# EAGLE design telescopicrobot (EAGLE 9.6.2)
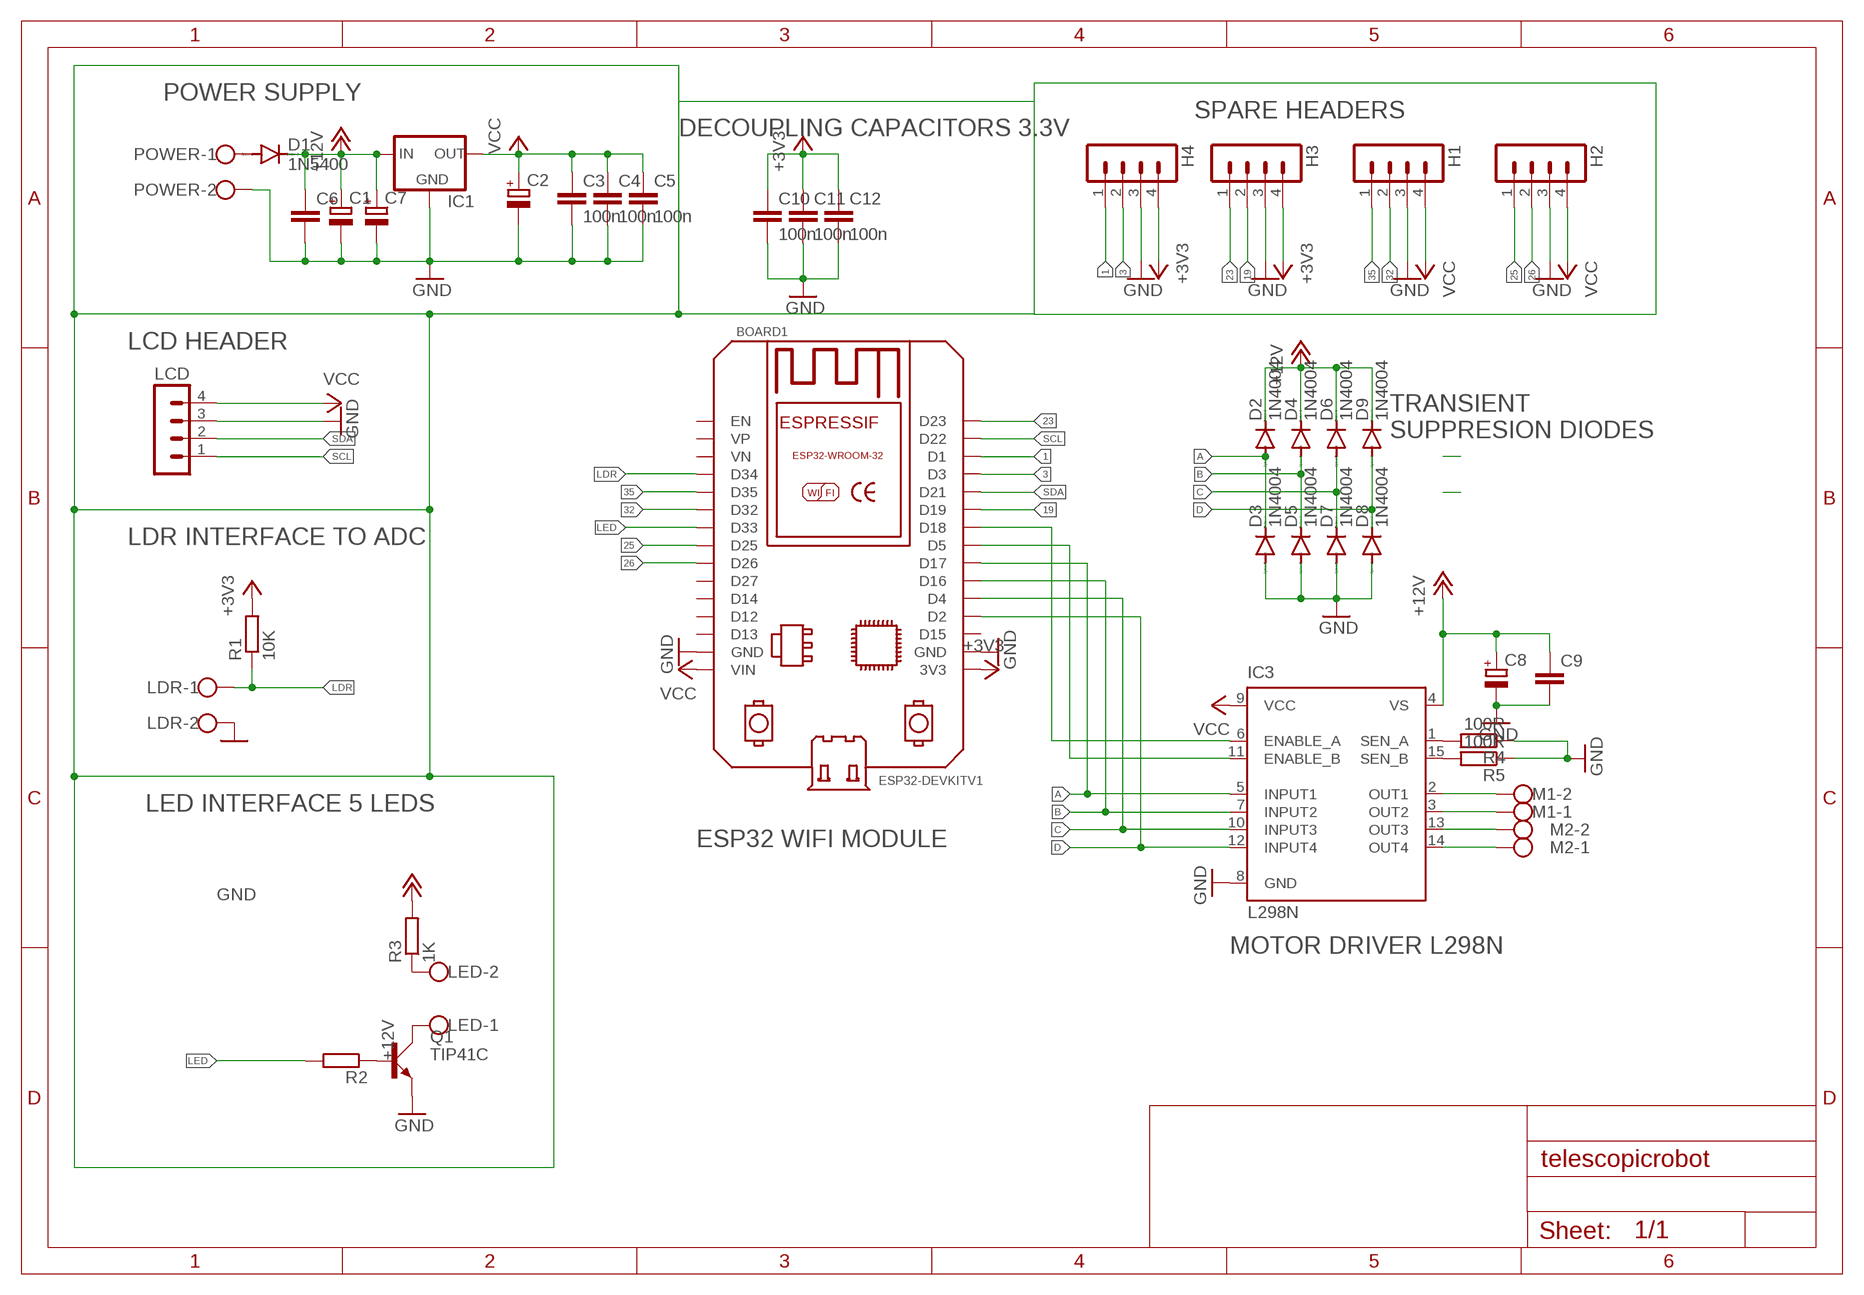
[diagram p0: schematic, sheet 1]

## Parts
BOARD1  ESP32DEVKITV1  [ESP32-DEVKITV1]
C1  CPOL-EUE5-10.5  [E5-10,5]
C2  CPOL-EUE2.5-5  [E2,5-5]
C3  100n  C2,5-3  [C2.5-3]
C4  100n  C2,5-3  [C2.5-3]
C5  100n  C2,5-3  [C2.5-3]
C6  C2,5-3  [C2.5-3]
C7  CPOL-EUE5-10.5  [E5-10,5]
C8  CPOL-EUE5-10.5  [E5-10,5]
C9  C2,5-3  [C2.5-3]
C10  100n  C2,5-3  [C2.5-3]
C11  100n  C2,5-3  [C2.5-3]
C12  100n  C2,5-3  [C2.5-3]
D1  1N5400  [DO201-15]
D2  1N4004  [DO41-10]
D3  1N4004  [DO41-10]
D4  1N4004  [DO41-10]
D5  1N4004  [DO41-10]
D6  1N4004  [DO41-10]
D7  1N4004  [DO41-10]
D8  1N4004  [DO41-10]
D9  1N4004  [DO41-10]
H1  MA04-1  [MA04-1]
H2  MA04-1  [MA04-1]
H3  MA04-1  [MA04-1]
H4  MA04-1  [MA04-1]
IC1  78XXS  [78XXS]
IC3  L298N  [MULTIWATT-15]
LCD  MA04-1  [MA04-1]
LDR  W237-102  [W237-102]
LED  W237-102  [W237-102]
M1  W237-102  [W237-102]
M2  W237-102  [W237-102]
POWER  W237-102  [W237-102]
Q1  TIP41C  [TO220AV]
R1  10K  R-EU_0207/12  [0207/12]
R2  R-EU_0207/12  [0207/12]
R3  1K  R-EU_0207/12  [0207/12]
R4  100R  R-EU_0207/12  [0207/12]
R5  100R  R-EU_0207/12  [0207/12]

## Nets
1: BOARD1.D1 H4.1
3: BOARD1.D3 H4.2
19: BOARD1.D19 H3.2
23: BOARD1.D23 H3.1
25: BOARD1.D25 H2.1
26: BOARD1.D26 H2.2
32: BOARD1.D32 H1.2
35: BOARD1.D35 H1.1
+3V3: BOARD1.3V3 C10.1 C11.1 C12.1 H3.4 H4.4 R1.2
+12V: C1.+ C6.1 C7.+ C8.+ C9.1 D1.C D2.C D4.C D6.C D9.C IC1.IN IC3.4(VS) R3.2
A: BOARD1.D17 D2.A D3.C IC3.5(INPUT1)
B: BOARD1.D16 D4.A D5.C IC3.7(INPUT2)
C: BOARD1.D4 D6.A D7.C IC3.10(INPUT3)
D: BOARD1.D2 D8.C D9.A IC3.12(INPUT4)
GND: BOARD1.GND BOARD1.GND@1(GND) C1.- C2.- C3.2 C4.2 C5.2 C6.2 C7.- C8.- C9.2 C10.2 C11.2 C12.2 D3.A D5.A D7.A D8.A H1.3 H2.3 H3.3 H4.3 IC1.GND IC3.8(GND) LCD.3 LDR.2 POWER.2 Q1.E R4.1 R5.1
LDR: BOARD1.D34 LDR.1 R1.1
LED: BOARD1.D33 R2.2
N$1: LED.1 Q1.C
N$2: IC3.3(OUT2) M1.1
N$3: IC3.2(OUT1) M1.2
N$4: IC3.14(OUT4) M2.1
N$5: IC3.13(OUT3) M2.2
N$6: Q1.B R2.1
N$7: BOARD1.D18 IC3.6(ENABLE_A)
N$8: D1.A POWER.1
N$9: LED.2 R3.1
N$13: BOARD1.D5 IC3.11(ENABLE_B)
N$143: IC3.1(SEN_A) R4.2
N$145: IC3.15(SEN_B) R5.2
SCL: BOARD1.D22 LCD.1
SDA: BOARD1.D21 LCD.2
VCC: BOARD1.VIN C2.+ C3.1 C4.1 C5.1 H1.4 H2.4 IC1.OUT IC3.9(VCC) LCD.4
Unconnected: BOARD1.D12 BOARD1.D13 BOARD1.D14 BOARD1.D15 BOARD1.D27 BOARD1.EN BOARD1.VN BOARD1.VP

## Notes on the sheet
- POWER SUPPLY
- SPARE HEADERS
- DECOUPLING CAPACITORS 3.3V
- LCD HEADER
- TRANSIENT
  SUPPRESION DIODES
- LDR INTERFACE TO ADC
- LED INTERFACE 5 LEDS
- ESP32 WIFI MODULE
- MOTOR DRIVER L298N

## Library data of the parts
BOARD1 = ESP32-DEVKITV1:ESP32DEVKITV1: https://github.com/shridattdudhat
C1 C2 C7 C8 = rcl:CPOL-EU: POLARIZED CAPACITOR, European symbol; SPICEPREFIX: C
C3-C6 C9-C12 = capacitor-wima:C: CAPACITOR naming: grid - package width
D1 = diode:1N5400: DIODE standard rectifier, 3 A, 50 V (Motorola)
D2-D9 = diode:1N4004: DIODE general purpose rectifier, 1 A
H1-H4 LCD = con-lstb:MA04-1: PIN HEADER; OC_FARNELL: unknown; OC_NEWARK: unknown
IC1 = v-reg:78XXS: VOLTAGE REGULATOR
IC3 = Itead_IC_110429:L298N: ICP007
LDR LED M1 M2 POWER = con-wago-500:W237-102: WAGO SCREW CLAMP; MPN: 237-102; OC_FARNELL: unknown; OC_NEWARK: 70K9898
Q1 = transistor-power:TIP41C: NPN TRANSISTOR
R1 R2 = rcl:R-EU_: RESISTOR, European symbol; SPICEPREFIX: R
R3-R5 = resistor:R-EU_: RESISTOR, European symbol

## Board
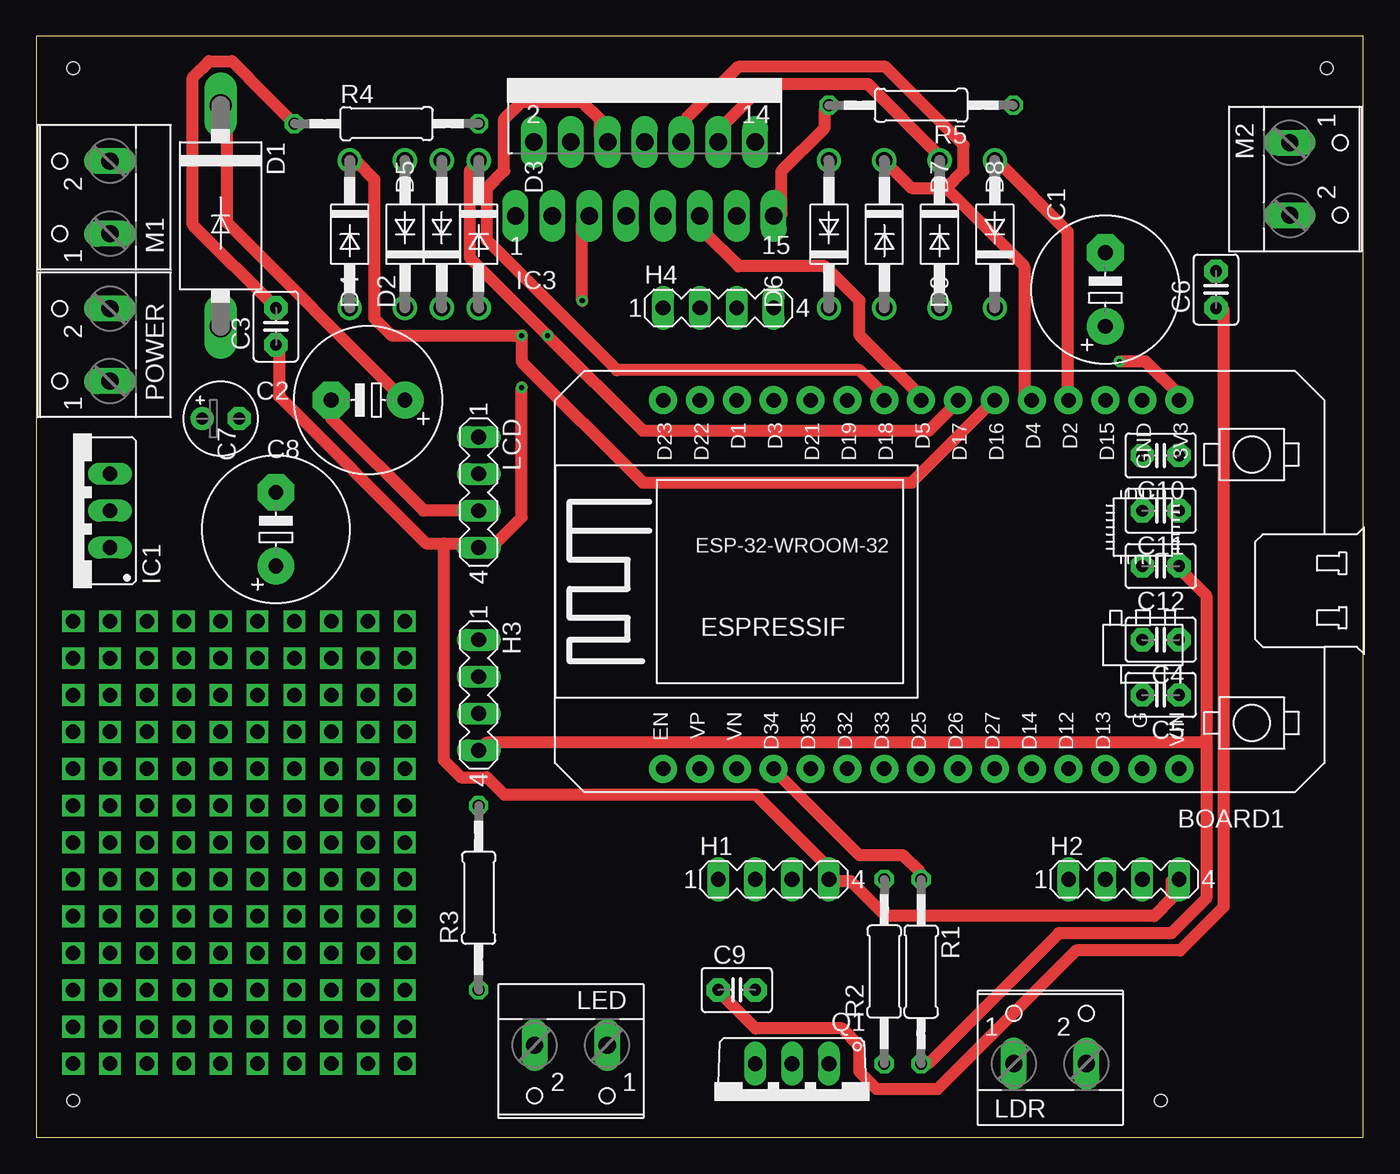
[diagram p1: board, top side]
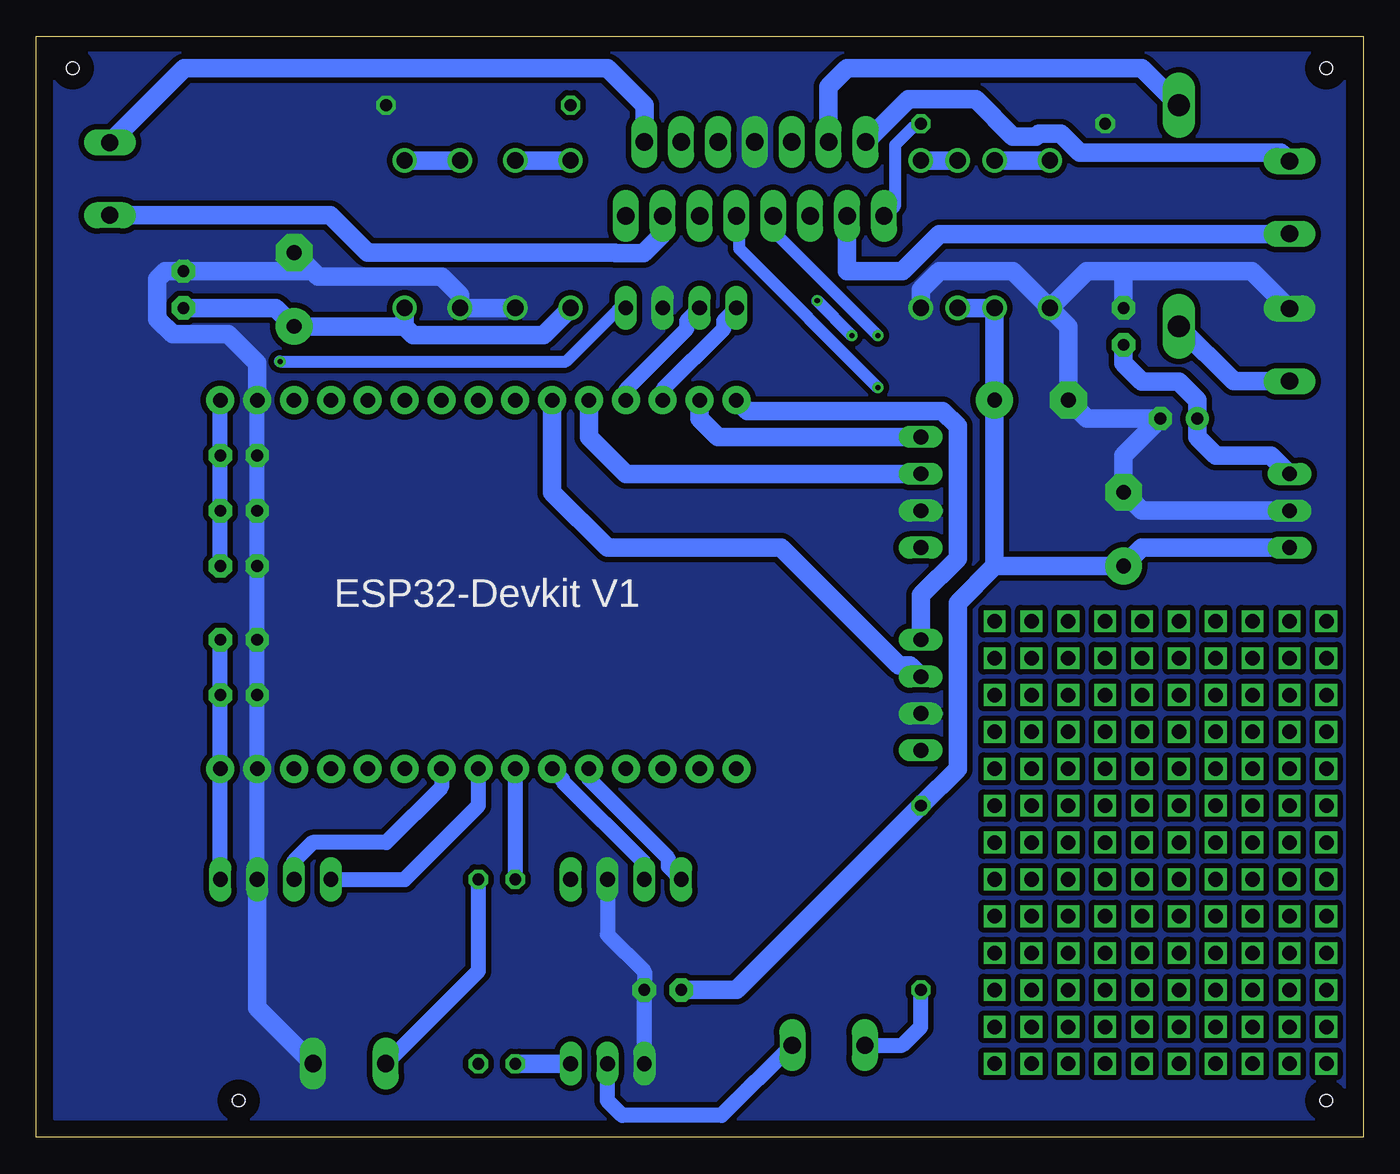
[diagram p2: board, bottom side, seen from below]

Size 91.42 x 75.87 mm. Coordinates in mm from the lower left corner, seen from the top.
Outline: 0,0 91.42,0 91.42,75.87 0,75.87 0,0
Copper layers (1*16): Top 0.035mm / dielectric 1.5mm / Bottom 0.035mm
Design rules "default *": minimum track width 32mil, minimum drill 0.35mm, track to track 15mil, track to pad 15mil, pad to pad 6mil, via to via 6mil, smd to smd 6mil, copper to edge 40mil, drill to drill 6mil, minimum pad ring 10mil, minimum via ring 8mil, stop-mask expansion 4mil, vias tented up to drill 0mil, thermal gap 0mil
Holes 0.85 mm at 2.54,2.54 88.9,73.66 2.54,73.66 77.47,2.54

### Footprints (pad centres in the part's own frame; a part is rotated, then mirrored left to right if it is on the bottom)
ESP32-DEVKITV1 = drill 1 pad 1.93: 3V3 0,0; D1 30.48,0; D2 7.62,0; D3 27.94,0; D4 10.16,0; D5 17.78,0; D12 7.62,25.4; D13 5.08,25.4; D14 10.16,25.4; D15 5.08,0; D16 12.7,0; D17 15.24,0; D18 20.32,0; D19 22.86,0; D21 25.4,0; D22 33.02,0; D23 35.56,0; D25 17.78,25.4; D26 15.24,25.4; D27 12.7,25.4; D32 22.86,25.4; D33 20.32,25.4; D34 27.94,25.4; D35 25.4,25.4; EN 35.56,25.4; GND 2.54,25.4; GND@1 2.54,0; VIN 0,25.4; VN 30.48,25.4; VP 33.02,25.4
E5-10,5 = drill 1.016 pad 2.54: + -2.54,0 | drill 1.016 pad 2.54 octagon: - 2.54,0
E2,5-5 = drill 0.813 pad 1.6: + -1.27,0 | drill 0.813 pad 1.6 octagon: - 1.27,0
C2.5-3 = drill 0.813 pad 1.6 octagon: 1 -1.27,0; 2 1.27,0
DO201-15 = drill 1.499 long: A 7.62,0; C -7.62,0
DO41-10 = drill 1.118: A 5.08,0; C -5.08,0
MA04-1 = drill 1.016 long: 1 -3.81,0; 2 -1.27,0; 3 1.27,0; 4 3.81,0
78XXS = drill 1.016 long: GND 0,-2.54; IN -2.54,-2.54; OUT 2.54,-2.54
MULTIWATT-15 = drill 1.2 long: 1 -8.89,-7.62; 2 -7.62,-2.54; 3 -6.35,-7.62; 4 -5.08,-2.54; 5 -3.81,-7.62; 6 -2.54,-2.54; 7 -1.27,-7.62; 8 0,-2.54; 9 1.27,-7.62; 10 2.54,-2.54; 11 3.81,-7.62; 12 5.08,-2.54; 13 6.35,-7.62; 14 7.62,-2.54; 15 8.89,-7.62
W237-102 = drill 1.194 long: 1 -2.5,-1.27; 2 2.5,-1.27
TO220AV = drill 1.016 long: B -2.54,-2.54; C 0,-2.54; E 2.54,-2.54
0207/12 = drill 0.813 octagon: 1 -6.35,0; 2 6.35,0

### Placement (x,y rotation side)
BOARD1  78.74,50.8 180 top
C1  73.66,58.42 90 top
C2  12.7,49.53 0 top
C3  16.51,55.88 90 top
C4  77.47,34.29 180 top
C5  77.47,30.48 180 top
C6  81.28,58.42 90 top
C7  16.51,41.91 90 top
C8  22.86,50.8 180 top
C9  48.26,10.16 0 top
C10  77.47,46.99 180 top
C11  77.47,43.18 180 top
C12  77.47,39.37 180 top
D1  12.7,63.5 270 top
D2  27.94,62.23 90 top
D3  30.48,62.23 270 top
D4  25.4,62.23 90 top
D5  21.59,62.23 270 top
D6  54.61,62.23 90 top
D7  58.42,62.23 270 top
D8  62.23,62.23 270 top
D9  66.04,62.23 90 top
H1  50.8,17.78 0 top
H2  74.93,17.78 0 top
H3  30.48,30.48 270 top
H4  46.99,57.15 0 top
IC1  2.54,43.18 90 top
IC3  41.91,71.12 0 top
LCD  30.48,44.45 270 top
LDR  69.85,6.35 0 top
LED  36.83,5.08 180 top
M1  3.81,64.77 90 top
M2  87.63,66.04 270 top
POWER  3.81,54.61 90 top
Q1  52.07,2.54 180 top
R1  60.96,11.43 270 top
R2  58.42,11.43 90 top
R3  30.48,16.51 90 top
R4  24.13,69.85 0 top
R5  60.96,71.12 180 top

### Tracks (layer width: path | path; a pad name or v marks a point on that pad's centre or on a via)
1
  Bottom 1.016: H4.1 44.07,56.26 44.07,55.7 48.26,51.51 BOARD1.D1
3
  Bottom 1.016: H4.2 46.61,56.26 46.61,55.7 50.8,51.51 BOARD1.D3
19
  Bottom 1.27: H3.2 31.24,32.51 31.98,32.51 40.11,40.64 52.07,40.64 55.88,44.45 BOARD1.D19
23
  Bottom 1.27: H3.1 30.48,37.36 27.94,39.9 27.94,49 28.98,50.04 42.42,50.04 BOARD1.D23
25
  Bottom 1.016: H2.1 66.04,17.78 60.96,22.86 BOARD1.D25
26
  Bottom 1.016: BOARD1.D26 63.5,24.13 67.31,20.32 72.39,20.32 73.66,19.05 H2.2
32
  Bottom 1.016: BOARD1.D32 55.19,24.71 55.19,24.57 49.53,18.9 H1.2
35
  Bottom 1.016: H1.1 47.88,18.67 47.88,19.23 53.34,24.69 BOARD1.D35
+3V3  (via drill 0.35)
  Top 0.813: 80.59,27.2 80.59,37.35 78.8,39.14 C12.1 | 80.59,27.2 80.59,16.46 78.21,14.07 70.45,14.07 61.49,5.12 R1.2 | 80.59,27.2 31.05,27.2 H3.4 | v74.62,53.47 76.42,53.47 78.8,51.08 BOARD1.3V3
  Bottom 0.813: v74.62,53.47 54.93,53.47 51.35,57.05 H4.4
  Bottom 1.016: C12.1 C11.1 C10.1 BOARD1.3V3
+12V
  Top 0.813: D1.C 13.14,70.78 13.14,63.02 25.08,51.08 C8.+ | C9.1 47.17,9.89 49.56,7.51 55.52,7.51 56.72,6.31 56.72,4.52 57.91,3.33 62.09,3.33 71.64,12.88 78.8,12.88 81.79,15.86 81.79,57.05 C6.1
  Bottom 1.27: IC1.IN 15.24,40.64 C7.+ 25.4,39.37 | 25.4,39.37 27.94,36.83 27.94,25.4 R3.2 43.18,10.16 C9.1 | 25.4,39.37 C8.+ D4.C D2.C | D6.C 56.46,55.3 65.46,55.3 66.04,55.88 | 66.04,55.88 D9.C | 66.04,55.88 C1.+ 74.93,57.15 C6.1 | D1.C 15.24,73.66 35.56,73.66 36.83,72.39 IC3.4
A  (via drill 0.35)
  Top 0.813: v37.62,57.65 37.62,63.02 IC3.5 | D3.C 30.46,67.2 29.86,66.6 29.86,60.63 v35.23,55.26 41.8,48.69 61.49,48.69 63.28,50.48 BOARD1.D17
  Bottom 0.813: v35.23,55.26 v37.62,57.65
  Bottom 1.27: D2.A D3.C
B  (via drill 0.35)
  Top 0.813: D5.C 22.1,67.2 23.29,66 23.29,56.45 24.49,55.26 v33.44,55.26 33.44,53.47 41.8,45.11 60.3,45.11 65.67,50.48 BOARD1.D16
  Bottom 0.813: v33.44,55.26 40.6,62.42 40.6,63.02 IC3.7
  Bottom 1.27: D5.C D4.A
C
  Top 0.813: 62.69,65.41 63.88,66.6 63.88,68.39 58.51,73.76 48.36,73.76 44.78,70.18 44.78,68.99 IC3.10 | 62.69,65.41 60.3,65.41 58.51,67.2 D7.C | 62.69,65.41 68.06,60.03 68.06,51.08 BOARD1.D4
  Bottom 1.27: D6.A D7.C
D
  Top 0.813: IC3.12 47.17,68.99 47.17,69.58 50.15,72.57 57.31,72.57 62.09,67.79 D8.C | BOARD1.D2 71.04,51.08 71.04,62.42 66.27,67.2 D9.A
  Bottom 1.27: D8.C D9.A
GND
  Top 0.813: LCD.3 26.67,43.18 20.32,49.53 C8.- | C3.2 10.79,62.87 10.79,73.04 11.91,74.16 13.49,74.16 14.61,73.04 14.61,73.02 R4.1
  Bottom 0.813: LCD.3 30.66,43.37 30.58,43.28
  Bottom 1.016: Q1.E C9.2 49.53,11.43 52.07,13.97 H1.3 | H2.3 BOARD1.GND C5.2 C4.2 C12.2 C11.2 C10.2 BOARD1.GND@1
  Bottom 1.27: D5.A 20.32,55.88 C8.- 19.05,49.53 C2.- 16.51,46.99 C7.- 15.24,43.18 IC1.GND | POWER.2 7.66,59.69 16.51,59.69 | D5.A 19.05,59.69 16.51,59.69 | D5.A 24.13,59.69 29.21,59.69 30.48,58.42 D3.A | H2.3 76.2,8.93 LDR.2 | C3.2 16.51,59.69 | D7.A D8.A 62.23,58.04 63.5,59.31 72.01,59.31 72.39,59.69 | C1.- 72.39,59.69 | 72.39,59.69 C6.2 82.55,59.69 83.1,59.14 83.1,56.4 82.03,55.33 78.19,55.33 76.2,53.34 BOARD1.GND@1
  pour Bottom: 1.27,74.93 90.17,74.93 90.17,1.27 1.27,1.27
LDR
  Top 0.813: BOARD1.D34 51.35,24.82 56.72,19.44 59.7,19.44 60.9,18.25 R1.1
  Bottom 1.016: LDR.1 60.96,11.47 R1.1
LED
  Bottom 1.016: BOARD1.D33 R2.2
N$1
  Bottom 1.016: LED.1 39.37,6.35 44.2,1.52 51.05,1.52 52.07,2.54 Q1.C
N$2
  Bottom 1.27: M1.1 5.12,62.23 29.21,62.23 31.75,59.69 35.56,59.69 IC3.3
N$3
  Bottom 1.27: M1.2 5.67,67.86 19.51,67.86 20.82,69.16 22.36,69.16 22.56,68.96 24.13,68.96 26.7,71.53 31.34,71.53 IC3.2
N$4
  Bottom 1.27: M2.1 81.24,73.66 52.07,73.66 49.53,71.12 IC3.14
N$5
  Bottom 1.27: IC3.13 48.26,62.23 49.58,60.91 51.5,60.91 51.55,60.96 68.58,60.96 71.16,63.54 M2.2
N$6
  Bottom 1.27: Q1.B R2.1
N$7
  Top 0.813: IC3.6 38.81,68.99 38.81,70.18 37.62,71.37 33.44,71.37 32.25,70.18 32.25,66.6 31.05,65.41 31.05,61.82 40,52.87 56.72,52.87 58.51,51.08 BOARD1.D18
N$8
  Bottom 1.27: POWER.1 8.93,52.11 D1.A
N$9
  Bottom 1.016: LED.2 31.75,6.35 30.48,7.62 R3.1
N$10  (via drill 1)
  other vias: 2.54,35.56
N$13
  Top 0.813: IC3.11 45.97,63.02 45.97,62.42 48.36,60.03 54.33,60.03 56.72,57.65 56.72,55.26 60.9,51.08 BOARD1.D5
N$14  (via drill 1)
  other vias: 2.54,33.02
N$15  (via drill 1)
  other vias: 2.54,30.48
N$16  (via drill 1)
  other vias: 2.54,27.94
N$17  (via drill 1)
  other vias: 2.54,25.4
N$18  (via drill 1)
  other vias: 2.54,22.86
N$19  (via drill 1)
  other vias: 2.54,20.32
N$20  (via drill 1)
  other vias: 2.54,17.78
N$21  (via drill 1)
  other vias: 2.54,15.24
N$22  (via drill 1)
  other vias: 2.54,12.7
N$23  (via drill 1)
  other vias: 2.54,10.16
N$24  (via drill 1)
  other vias: 2.54,7.62
N$25  (via drill 1)
  other vias: 2.54,5.08
N$26  (via drill 1)
  other vias: 5.08,35.56
N$27  (via drill 1)
  other vias: 5.08,33.02
N$28  (via drill 1)
  other vias: 5.08,30.48
N$29  (via drill 1)
  other vias: 5.08,27.94
N$30  (via drill 1)
  other vias: 5.08,25.4
N$31  (via drill 1)
  other vias: 5.08,22.86
N$32  (via drill 1)
  other vias: 5.08,20.32
N$33  (via drill 1)
  other vias: 5.08,17.78
N$34  (via drill 1)
  other vias: 5.08,15.24
N$35  (via drill 1)
  other vias: 5.08,12.7
N$36  (via drill 1)
  other vias: 5.08,10.16
N$37  (via drill 1)
  other vias: 5.08,7.62
N$38  (via drill 1)
  other vias: 5.08,5.08
N$39  (via drill 1)
  other vias: 7.62,35.56
N$40  (via drill 1)
  other vias: 7.62,33.02
N$41  (via drill 1)
  other vias: 7.62,30.48
N$42  (via drill 1)
  other vias: 7.62,27.94
N$43  (via drill 1)
  other vias: 7.62,25.4
N$44  (via drill 1)
  other vias: 7.62,22.86
N$45  (via drill 1)
  other vias: 7.62,20.32
N$46  (via drill 1)
  other vias: 7.62,17.78
N$47  (via drill 1)
  other vias: 7.62,15.24
N$48  (via drill 1)
  other vias: 7.62,12.7
N$49  (via drill 1)
  other vias: 7.62,10.16
N$50  (via drill 1)
  other vias: 7.62,7.62
N$51  (via drill 1)
  other vias: 7.62,5.08
N$52  (via drill 1)
  other vias: 10.16,35.56
N$53  (via drill 1)
  other vias: 10.16,33.02
N$54  (via drill 1)
  other vias: 10.16,30.48
N$55  (via drill 1)
  other vias: 10.16,27.94
N$56  (via drill 1)
  other vias: 10.16,25.4
N$57  (via drill 1)
  other vias: 10.16,22.86
N$58  (via drill 1)
  other vias: 10.16,20.32
N$59  (via drill 1)
  other vias: 10.16,17.78
N$60  (via drill 1)
  other vias: 10.16,15.24
N$61  (via drill 1)
  other vias: 10.16,12.7
N$62  (via drill 1)
  other vias: 10.16,10.16
N$63  (via drill 1)
  other vias: 10.16,7.62
N$64  (via drill 1)
  other vias: 10.16,5.08
N$65  (via drill 1)
  other vias: 12.7,35.56
N$66  (via drill 1)
  other vias: 12.7,33.02
N$67  (via drill 1)
  other vias: 12.7,30.48
N$68  (via drill 1)
  other vias: 12.7,27.94
N$69  (via drill 1)
  other vias: 12.7,25.4
N$70  (via drill 1)
  other vias: 12.7,22.86
N$71  (via drill 1)
  other vias: 12.7,20.32
N$72  (via drill 1)
  other vias: 12.7,17.78
N$73  (via drill 1)
  other vias: 12.7,15.24
N$74  (via drill 1)
  other vias: 12.7,12.7
N$75  (via drill 1)
  other vias: 12.7,10.16
N$76  (via drill 1)
  other vias: 12.7,7.62
N$77  (via drill 1)
  other vias: 12.7,5.08
N$78  (via drill 1)
  other vias: 15.24,35.56
N$79  (via drill 1)
  other vias: 15.24,33.02
N$80  (via drill 1)
  other vias: 15.24,30.48
N$81  (via drill 1)
  other vias: 15.24,27.94
N$82  (via drill 1)
  other vias: 15.24,25.4
N$83  (via drill 1)
  other vias: 15.24,22.86
N$84  (via drill 1)
  other vias: 15.24,20.32
N$85  (via drill 1)
  other vias: 15.24,17.78
N$86  (via drill 1)
  other vias: 15.24,15.24
N$87  (via drill 1)
  other vias: 15.24,12.7
N$88  (via drill 1)
  other vias: 15.24,10.16
N$89  (via drill 1)
  other vias: 15.24,7.62
N$90  (via drill 1)
  other vias: 15.24,5.08
N$91  (via drill 1)
  other vias: 17.78,35.56
N$92  (via drill 1)
  other vias: 17.78,33.02
N$93  (via drill 1)
  other vias: 17.78,30.48
N$94  (via drill 1)
  other vias: 17.78,27.94
N$95  (via drill 1)
  other vias: 17.78,25.4
N$96  (via drill 1)
  other vias: 17.78,22.86
N$97  (via drill 1)
  other vias: 17.78,20.32
N$98  (via drill 1)
  other vias: 17.78,17.78
N$99  (via drill 1)
  other vias: 17.78,15.24
N$100  (via drill 1)
  other vias: 17.78,12.7
N$101  (via drill 1)
  other vias: 17.78,10.16
N$102  (via drill 1)
  other vias: 17.78,7.62
N$103  (via drill 1)
  other vias: 17.78,5.08
N$104  (via drill 1)
  other vias: 20.32,35.56
N$105  (via drill 1)
  other vias: 20.32,33.02
N$106  (via drill 1)
  other vias: 20.32,30.48
N$107  (via drill 1)
  other vias: 20.32,27.94
N$108  (via drill 1)
  other vias: 20.32,25.4
N$109  (via drill 1)
  other vias: 20.32,22.86
N$110  (via drill 1)
  other vias: 20.32,20.32
N$111  (via drill 1)
  other vias: 20.32,17.78
N$112  (via drill 1)
  other vias: 20.32,15.24
N$113  (via drill 1)
  other vias: 20.32,12.7
N$114  (via drill 1)
  other vias: 20.32,10.16
N$115  (via drill 1)
  other vias: 20.32,7.62
N$116  (via drill 1)
  other vias: 20.32,5.08
N$117  (via drill 1)
  other vias: 22.86,35.56
N$118  (via drill 1)
  other vias: 22.86,33.02
N$119  (via drill 1)
  other vias: 22.86,30.48
N$120  (via drill 1)
  other vias: 22.86,27.94
N$121  (via drill 1)
  other vias: 22.86,25.4
N$122  (via drill 1)
  other vias: 22.86,22.86
N$123  (via drill 1)
  other vias: 22.86,20.32
N$124  (via drill 1)
  other vias: 22.86,17.78
N$125  (via drill 1)
  other vias: 22.86,15.24
N$126  (via drill 1)
  other vias: 22.86,12.7
N$127  (via drill 1)
  other vias: 22.86,10.16
N$128  (via drill 1)
  other vias: 22.86,7.62
N$129  (via drill 1)
  other vias: 22.86,5.08
N$130  (via drill 1)
  other vias: 25.4,35.56
N$131  (via drill 1)
  other vias: 25.4,33.02
N$132  (via drill 1)
  other vias: 25.4,30.48
N$133  (via drill 1)
  other vias: 25.4,27.94
N$134  (via drill 1)
  other vias: 25.4,25.4
N$135  (via drill 1)
  other vias: 25.4,22.86
N$136  (via drill 1)
  other vias: 25.4,20.32
N$137  (via drill 1)
  other vias: 25.4,17.78
N$138  (via drill 1)
  other vias: 25.4,15.24
N$139  (via drill 1)
  other vias: 25.4,12.7
N$140  (via drill 1)
  other vias: 25.4,10.16
N$141  (via drill 1)
  other vias: 25.4,7.62
N$142  (via drill 1)
  other vias: 25.4,5.08
N$143
  Bottom 0.813: R4.2 31.05,69.58 32.25,68.39 32.25,64.21 32.84,63.61 IC3.1
N$145
  Top 0.813: R5.2 54.33,70.78 54.33,69.58 51.35,66.6 51.35,63.61 IC3.15
SCL
  Bottom 1.27: BOARD1.D22 45.72,49.53 44.45,48.26 LCD.1
SDA
  Bottom 1.27: BOARD1.D21 53.34,48.26 50.8,45.72 LCD.2
VCC  (via drill 0.35)
  Top 0.813: H2.4 78.21,17.65 78.21,16.46 77.01,15.27 58.51,15.27 56.12,17.65 54.93,17.65 H1.4 54.33,18.25 54.33,18.85 49.56,23.62 32.25,23.62 31.05,24.82 29.26,24.82 28.07,26.01 28.07,40.93 | 28.07,40.93 26.87,40.93 16.73,51.08 16.73,54.06 C3.1 | 28.07,40.93 30.46,40.93 LCD.4 31.05,40.34 33.44,42.72 v33.44,51.68
  Bottom 0.813: v33.44,51.68 42.99,61.23 42.99,63.02 IC3.9
  Bottom 1.016: H2.4 BOARD1.VIN C5.1 C4.1
  Bottom 1.27: IC1.OUT 6.35,46.99 10.16,46.99 11.43,48.26 C2.+ 11.43,50.8 12.7,52.07 15.24,52.07 16.51,53.34 C3.1